# EAGLE design untitled (EAGLE 6.5.0)
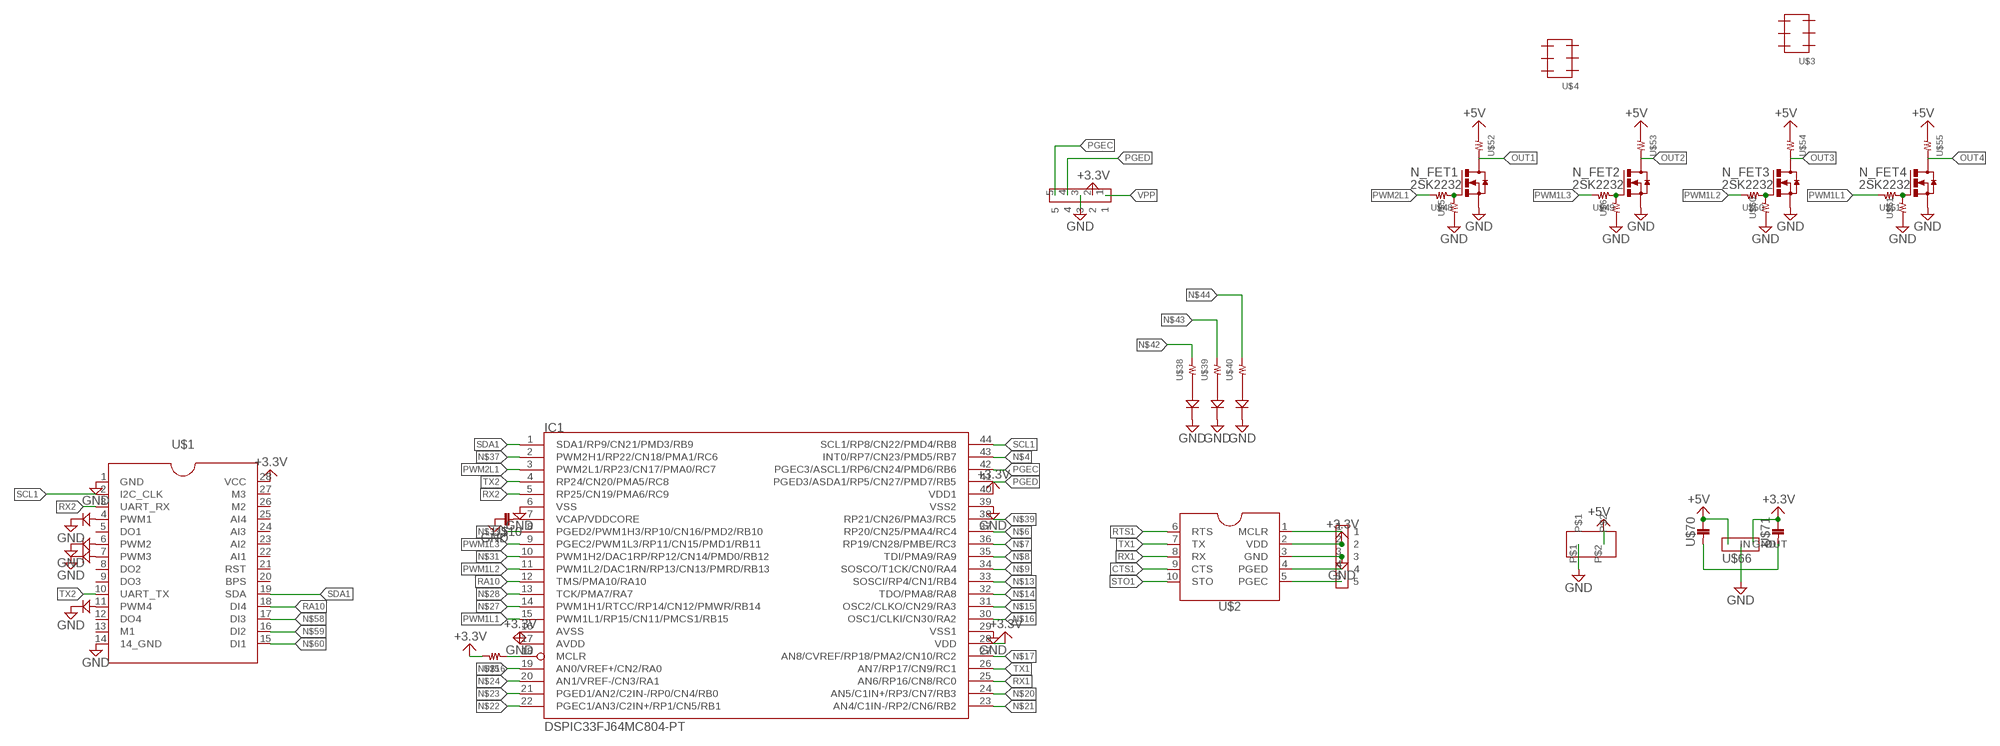
[diagram p0: schematic, sheet 1]

## Parts
IC1  DSPIC33FJ64MC804-PT  [TQFP44]
N_FET1  2SK2232  [TO-220_V]
N_FET2  2SK2232  [TO-220_V]
N_FET3  2SK2232  [TO-220_V]
N_FET4  2SK2232  [TO-220_V]
U$1  TWE-LITE  [DIP28]
U$2  SBDBT  [DIL10]
U$3  PIN_HEADER_32  [PIN_HEADER_3*2]
U$4  PIN_HEADER_32  [PIN_HEADER_3*2]
U$5  RESISTOR__SMD  [1608]
U$6  RESISTOR__SMD  [1608]
U$10  2012  [2012]
U$16  RESISTOR__SMD  [1608]
U$18  PIN_HEADER_5  [PIN_HEADER_5]
U$24  PIN_HEADER_5  [PIN_HEADER_5]
U$27  5MMLED  [5MM]
U$28  5MMLED  [5MM]
U$29  5MMLED  [5MM]
U$30  5MMLED  [5MM]
U$35  3MMLED  [3MM]
U$36  3MMLED  [3MM]
U$37  3MMLED  [3MM]
U$38  RESISTOR__SMD  [1608]
U$39  RESISTOR__SMD  [1608]
U$40  RESISTOR__SMD  [1608]
U$48  RESISTOR__SMD  [1608]
U$49  RESISTOR__SMD  [1608]
U$50  RESISTOR__SMD  [1608]
U$51  RESISTOR__SMD  [1608]
U$52  RESISTOR__SMD  [1608]
U$53  RESISTOR__SMD  [1608]
U$54  RESISTOR__SMD  [1608]
U$55  RESISTOR__SMD  [1608]
U$60  RESISTOR__SMD  [1608]
U$61  RESISTOR__SMD  [1608]
U$66  TA48M033F  [ＴＡ４８]
U$70  1608  [1608]
U$71  3225  [3225]
U$72  PIN_HEADER_2  [PIN_HEADER_2S]

## Nets
+3.3V: IC1.17(AVDD) IC1.28(VDD) IC1.40(VDD1) U$1.28(VCC) U$2.2(VDD) U$16.2 U$18.2 U$24.2 U$66.3(OUT) U$71.P$1
+5V: U$52.1 U$53.1 U$54.1 U$55.1 U$66.1(IN) U$70.P$1 U$72.P$2
CTS1: U$2.9(CTS)
GND: IC1.6(VSS) IC1.16(AVSS) IC1.29(VSS1) IC1.39(VSS2) N_FET1.3(S) N_FET2.3(S) N_FET3.3(S) N_FET4.3(S) U$1.1(GND) U$1.14(14_GND) U$2.3(GND) U$5.1 U$6.1 U$10.1 U$18.3 U$24.3 U$27.K U$28.K U$29.K U$30.K U$35.K U$36.K U$37.K U$60.1 U$61.1 U$66.2(GND) U$70.P$2 U$71.P$2 U$72.P$1
N$1: U$35.A U$38.1
N$4: IC1.43(INT0/RP7/CN23/PMD5/RB7)
N$6: IC1.37(RP20/CN25/PMA4/RC4)
N$7: IC1.36(RP19/CN28/PMBE/RC3)
N$8: IC1.35(TDI/PMA9/RA9)
N$9: IC1.34(SOSCO/T1CK/CN0/RA4)
N$10: U$2.4(PGED) U$24.4
N$11: U$2.1(MCLR) U$24.1
N$12: U$2.5(PGEC) U$24.5
N$13: IC1.33(SOSCI/RP4/CN1/RB4)
N$14: IC1.32(TDO/PMA8/RA8)
N$15: IC1.31(OSC2/CLKO/CN29/RA3)
N$16: IC1.30(OSC1/CLKI/CN30/RA2)
N$17: IC1.27(AN8/CVREF/RP18/PMA2/CN10/RC2)
N$18: U$1.4(PWM1) U$27.A
N$19: U$1.6(PWM2) U$28.A
N$20: IC1.24(AN5/C1IN+/RP3/CN7/RB3)
N$21: IC1.23(AN4/C1IN-/RP2/CN6/RB2)
N$22: IC1.22(PGEC1/AN3/C2IN+/RP1/CN5/RB1)
N$23: IC1.21(PGED1/AN2/C2IN-/RP0/CN4/RB0)
N$24: IC1.20(AN1/VREF-/CN3/RA1)
N$25: IC1.19(AN0/VREF+/CN2/RA0)
N$27: IC1.14(PWM1H1/RTCC/RP14/CN12/PMWR/RB14)
N$28: IC1.13(TCK/PMA7/RA7)
N$31: IC1.10(PWM1H2/DAC1RP/RP12/CN14/PMD0/RB12)
N$33: IC1.8(PGED2/PWM1H3/RP10/CN16/PMD2/RB10)
N$34: U$1.7(PWM3) U$29.A
N$35: U$1.11(PWM4) U$30.A
N$37: IC1.2(PWM2H1/RP22/CN18/PMA1/RC6)
N$38: U$36.A U$39.1
N$39: IC1.38(RP21/CN26/PMA3/RC5)
N$41: U$37.A U$40.1
N$42: U$38.2
N$43: U$39.2
N$44: U$40.2
N$45: N_FET1.1(G) U$5.2 U$48.1
N$46: N_FET2.1(G) U$6.2 U$49.1
N$47: N_FET3.1(G) U$50.1 U$60.2
N$48: N_FET4.1(G) U$51.1 U$61.2
N$58: U$1.17(DI3)
N$59: U$1.16(DI2)
N$60: U$1.15(DI1)
OUT1: N_FET1.2(D) U$52.2
OUT2: N_FET2.2(D) U$53.2
OUT3: N_FET3.2(D) U$54.2
OUT4: N_FET4.2(D) U$55.2
PGEC: IC1.42(PGEC3/ASCL1/RP6/CN24/PMD6/RB6) U$18.5
PGED: IC1.41(PGED3/ASDA1/RP5/CN27/PMD7/RB5) U$18.4
PWM1L1: IC1.15(PWM1L1/RP15/CN11/PMCS1/RB15) U$51.2
PWM1L2: IC1.11(PWM1L2/DAC1RN/RP13/CN13/PMRD/RB13) U$50.2
PWM1L3: IC1.9(PGEC2/PWM1L3/RP11/CN15/PMD1/RB11) U$49.2
PWM2L1: IC1.3(PWM2L1/RP23/CN17/PMA0/RC7) U$48.2
RA10: IC1.12(TMS/PMA10/RA10) U$1.18(DI4)
RTS1: U$2.6(RTS)
RX1: IC1.25(AN6/RP16/CN8/RC0) U$2.8(RX)
RX2: IC1.5(RP25/CN19/PMA6/RC9) U$1.3(UART_RX)
SCL1: IC1.44(SCL1/RP8/CN22/PMD4/RB8) U$1.2(I2C_CLK)
SDA1: IC1.1(SDA1/RP9/CN21/PMD3/RB9) U$1.19(SDA)
STO1: U$2.10(STO)
TX1: IC1.26(AN7/RP17/CN9/RC1) U$2.7(TX)
TX2: IC1.4(RP24/CN20/PMA5/RC8) U$1.10(UART_TX)
VCAP/VDDCORE: IC1.7(VCAP/VDDCORE) U$10.2
VPP: IC1.18(MCLR) U$16.1 U$18.1
Unconnected: U$1.5(DO1) U$1.8(DO2) U$1.9(DO3) U$1.12(DO4) U$1.13(M1) U$1.20(BPS) U$1.21(RST) U$1.22(AI1) U$1.23(AI2) U$1.24(AI3) U$1.25(AI4) U$1.26(M2) U$1.27(M3) U$3.P$1 U$3.P$2 U$3.P$3 U$3.P$4 U$3.P$5 U$3.P$6 U$4.P$1 U$4.P$2 U$4.P$3 U$4.P$4 U$4.P$5 U$4.P$6

## Library data of the parts
IC1 = microchip-dspic33fjxxmc (1):DSPIC33FJ64MC804: dsPIC33FJ32MC302/304, dsPIC33FJ64MCX02/X04, AND dsPIC33FJ128MCX02/X04 High-Performance, 16-bit Digital Signal Controllers Package:44 Pin TQFP Operating Range: * Up to 40 MIPS operation (at 3.0V -3.6V): - Industrial temperature range (-40°C to +85°C) - Extended temperature range (-40°C to +125°C) High-Performance DSC CPU: * Modified Harvard architecture * C compiler optimized instruction set * 16-bit wide data path * 24-bit wide instructions * Linear program memory addressing up to 4M instruction words * Linear data memory addressing up to 64 Kbytes * 83 base instructions: mostly 1 word/1 cycle * Two 40-bit accumulators with rounding and saturation options * Flexible and powerful addressing modes: - Indirect - Modulo - Bit-Reversed * Software stack * 16 x 16 fractional/integer multiply operations * 32/16 and 16/16 divide operations * Single-cycle multiply and accumulate: - Accumulator write back for DSP operations - Dual data fetch * Up to ±16-bit shifts for up to 40-bit data Direct Memory Access (DMA): * 8-channel hardware DMA * Up to 2 Kbytes dual ported DMA buffer area (DMA RAM) to store data transferred via DMA: - Allows data transfer between RAM and a peripheral while CPU is executing code (no cycle stealing) * Most peripherals support DMA Timers/Capture/Compare/PWM: * Timer/Counters, up to five 16-bit timers: - Can pair up to make two 32-bit timers - One timer runs as a Real-Time Clock with an external 32.768 kHz oscillator - Programmable prescaler * Input Capture (up to four channels): - Capture on up, down or both edges - 16-bit capture input functions - 4-deep FIFO on each capture * Output Compare (up to four channels): - Single or Dual 16-bit Compare mode - 16-bit Glitchless PWM mode * Hardware Real-Time Clock/Calendar (RTCC): - Provides clock, calendar, and alarm functions Interrupt Controller: * 5-cycle latency * Up to 53 available interrupt sources * Up to three external interrupts * Seven programmable priority levels * Five processor exceptions Digital I/O: * Peripheral pin Select functionality * Up to 35 programmable digital I/O pins * Wake-up/Interrupt-on-Change for up to 31 pins * Output pins can drive from 3.0V to 3.6V * Up to 5V output with open drain configuration * All digital input pins are 5V tolerant * 4 mA sink on all I/O pins On-Chip Flash and SRAM: * Flash program memory (up to 128 Kbytes) * Data SRAM (up to 16 Kbytes) * Boot, Secure, and General Security for program Flash System Management: * Flexible clock options: - External, crystal, resonator, internal RC - Fully integrated Phase-Locked Loop (PLL) - Extremely low jitter PLL * Power-up Timer * Oscillator Start-up Timer/Stabilizer * Watchdog Timer with its own RC oscillator * Fail-Safe Clock Monitor * Reset by multiple sources Power Management: * On-chip 2.5V voltage regulator * Switch between clock sources in real time * Idle, Sleep, and Doze modes with fast wake-up Analog-to-Digital Converters (ADCs): * 10-bit, 1.1 Msps or 12-bit, 500 Ksps conversion: - Two and four simultaneous samples (10-bit ADC) - Up to nine input channels with auto-scanning - Conversion start can be manual or synchronized with one of four trigger sources - Conversion possible in Sleep mode - ±2 LSb max integral nonlinearity - ±1 LSb max differential nonlinearity Audio Digital-to-Analog Converter (DAC): - 16-bit Dual Channel DAC module - 100 Ksps maximum sampling rate - Second-Order Digital Delta-Sigma Modulator Comparator Module: * Two analog comparators with programmable input/output configuration CMOS Flash Technology: * Low-power, high-speed Flash technology * Fully static design * 3.3V (±10%) operating voltage * Industrial and Extended temperature * Low power consumption Motor Control Peripherals: * 6-channel 16-bit Motor Control PWM: - Three duty cycle generators - Independent or Complementary mode - Programmable dead-time and output polarity - Edge-aligned or center-aligned - Manual output override control - One Fault input - Trigger for ADC conversions - PWM frequency for 16-bit resolution (@ 40 MIPS) = 1220 Hz for Edge-Aligned mode, 610 Hz for Center-Aligned mode - PWM frequency for 11-bit resolution (@ 40 MIPS) = 39.1 kHz for Edge-Aligned mode, 19.55 kHz for Center-Aligned mode * 2-channel 16-bit Motor Control PWM: - One duty cycle generator - Independent or Complementary mode - Programmable dead time and output polarity - Edge-aligned or center-aligned - Manual output override control - One Fault input - Trigger for ADC conversions - PWM frequency for 16-bit resolution (@ 40 MIPS) = 1220 Hz for Edge-Aligned mode, 610 Hz for Center-Aligned mode - PWM frequency for 11-bit resolution (@ 40 MIPS) = 39.1 kHz for Edge-Aligned mode, 19.55 kHz for Center-Aligned mode * 2-Quadrature Encoder Interface module: - Phase A, Phase B, and index pulse input - 16-bit up/down position counter - Count direction status - Position Measurement (x2 and x4) mode - Programmable digital noise filters on inputs - Alternate 16-bit Timer/Counter mode - Interrupt on position counter rollover/underflow
N_FET1-N_FET4 = 06_FET:2SK2232
U$1 = 12_module:TWE-LITE
U$2 = 12_module:SBDBT
U$3 U$4 = 08_CONECTOR:PIN_HEADER_3*2
U$5 U$6 U$16 U$38-U$40 U$48-U$55 U$60 U$61 = 01_R:RESISTOR__SMD
U$10 = 02_C:2012
U$18 U$24 = 08_CONECTOR:PIN_HEADER_5
U$27-U$30 = 10_LED:5MMLED
U$35-U$37 = 10_LED:3MMLED
U$66 = 04_IC:TA48M033F
U$70 = 02_C:1608
U$71 = 02_C:3225
U$72 = 08_CONECTOR:PIN_HEADER_2

## Board
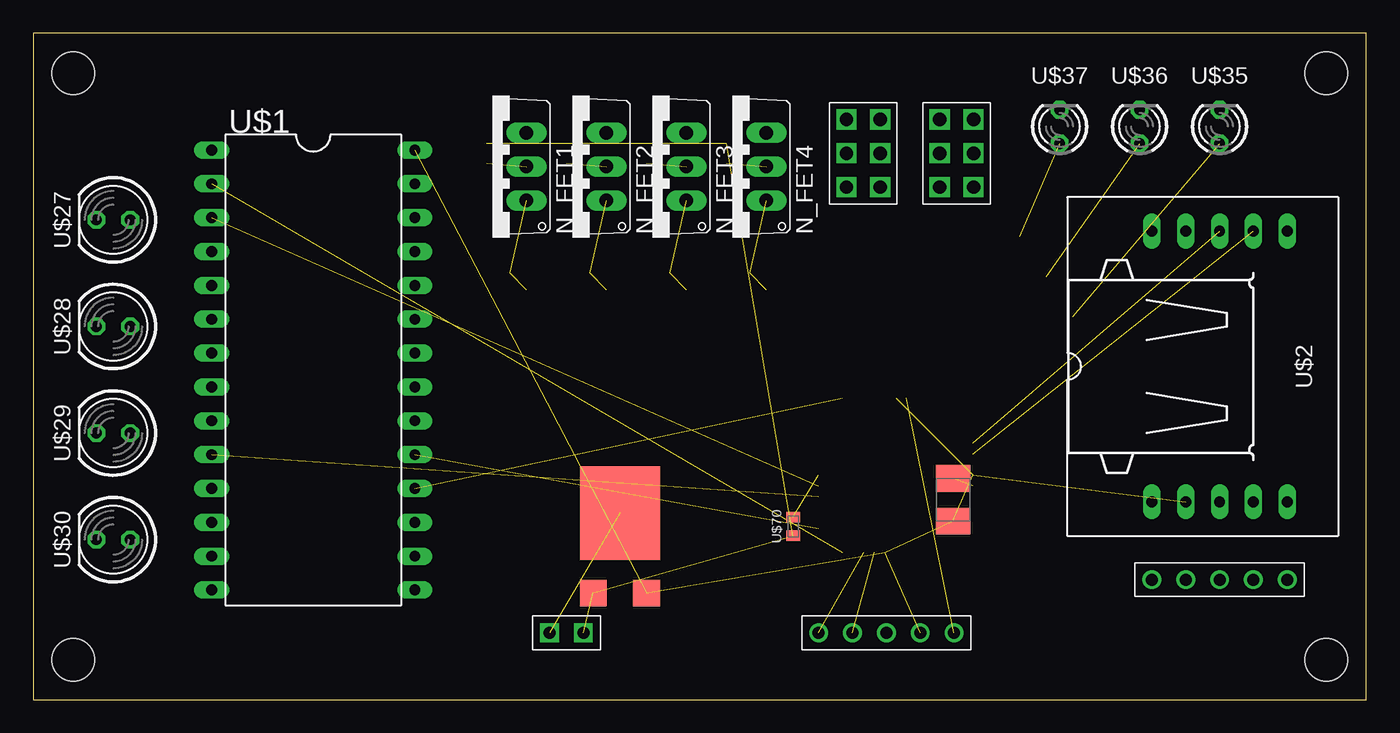
[diagram p1: board, top side]
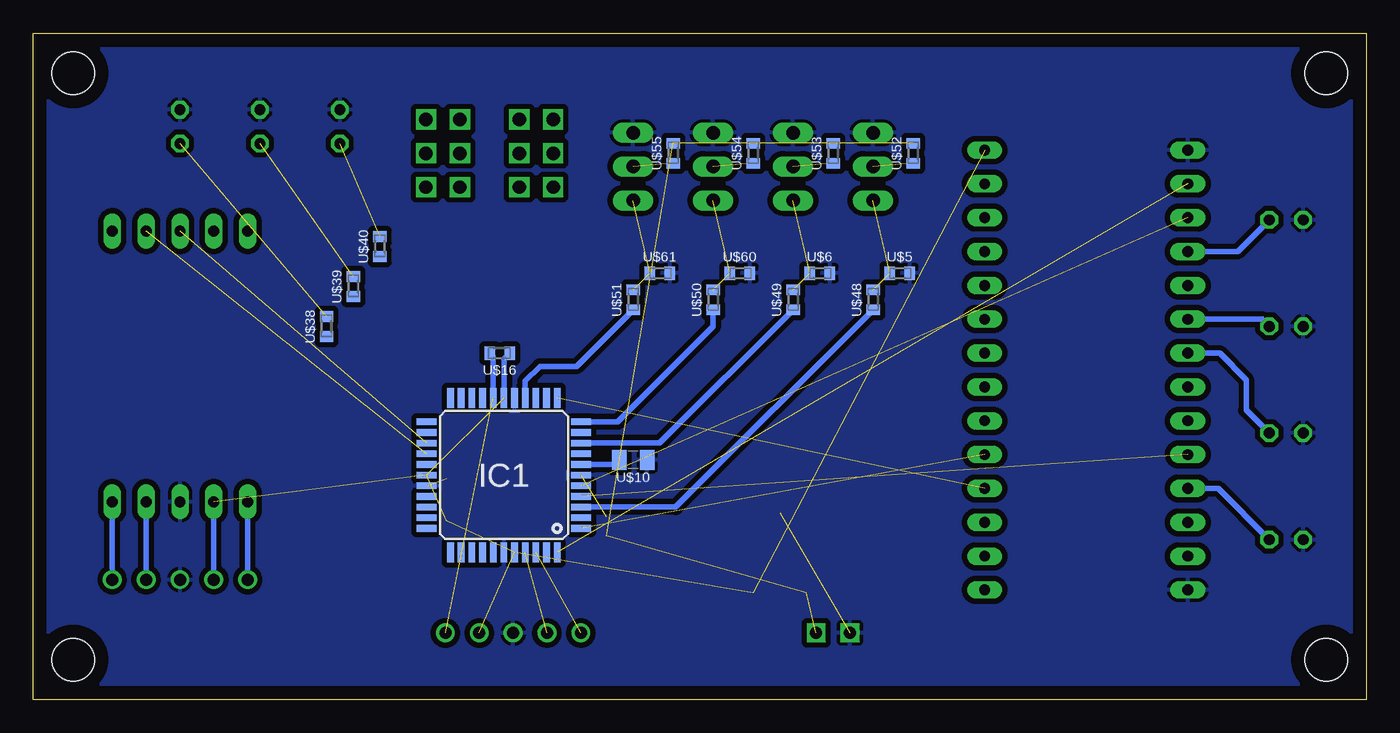
[diagram p2: board, bottom side, seen from below]

Size 100 x 50 mm. Coordinates in mm from the lower left corner, seen from the top.
Outline: 0,0 100,0 100,50 0,50 0,0
Copper layers (1*16): Top 0.035mm / dielectric 1.5mm / Bottom 0.035mm
Design rules "default": minimum track width 10mil, minimum drill 24mil, track to track 8mil, track to pad 8mil, pad to pad 8mil, via to via 8mil, smd to smd 8mil, copper to edge 40mil, drill to drill 8mil, minimum pad ring 10mil, minimum via ring 8mil, stop-mask expansion 4mil, vias tented up to drill 0mil, thermal gap 10mil
Holes 3.2 mm at 3,47 3,3 97,3 97,47

### Footprints (pad centres in the part's own frame; a part is rotated, then mirrored left to right if it is on the bottom)
TQFP44 = smd 1.5 x 0.5: 1 -5.8,4; 2 -5.8,3.2; 3 -5.8,2.4; 4 -5.8,1.6; 5 -5.8,0.8; 6 -5.8,0; 7 -5.8,-0.8; 8 -5.8,-1.6; 9 -5.8,-2.4; 10 -5.8,-3.2; 11 -5.8,-4; 23 5.8,-4; 24 5.8,-3.2; 25 5.8,-2.4; 26 5.8,-1.6; 27 5.8,-0.8; 28 5.8,0; 29 5.8,0.8; 30 5.8,1.6; 31 5.8,2.4; 32 5.8,3.2; 33 5.8,4 | smd 0.5 x 1.5: 12 -4,-5.8; 13 -3.2,-5.8; 14 -2.4,-5.8; 15 -1.6,-5.8; 16 -0.8,-5.8; 17 0,-5.8; 18 0.8,-5.8; 19 1.6,-5.8; 20 2.4,-5.8; 21 3.2,-5.8; 22 4,-5.8; 34 4,5.8; 35 3.2,5.8; 36 2.4,5.8; 37 1.6,5.8; 38 0.8,5.8; 39 0,5.8; 40 -0.8,5.8; 41 -1.6,5.8; 42 -2.4,5.8; 43 -3.2,5.8; 44 -4,5.8
TO-220_V = drill 1.016 long: 1 -2.54,0; 2 0,0; 3 2.54,0
DIP28 = drill 0.813 long: 1 -15.24,-7.62; 2 -12.7,-7.62; 3 -10.16,-7.62; 4 -7.62,-7.62; 5 -5.08,-7.62; 6 -2.54,-7.62; 7 0,-7.62; 8 2.54,-7.62; 9 5.08,-7.62; 10 7.62,-7.62; 11 10.16,-7.62; 12 12.7,-7.62; 13 15.24,-7.62; 14 17.78,-7.62; 15 17.78,7.62; 16 15.24,7.62; 17 12.7,7.62; 18 10.16,7.62; 19 7.62,7.62; 20 5.08,7.62; 21 2.54,7.62; 22 0,7.62; 23 -2.54,7.62; 24 -5.08,7.62; 25 -7.62,7.62; 26 -10.16,7.62; 27 -12.7,7.62; 28 -15.24,7.62
DIL10 = drill 0.813 long: 1 -10.16,5.08; 2 -10.16,2.54; 3 -10.16,0; 4 -10.16,-2.54; 5 -10.16,-5.08; 6 10.16,-5.08; 7 10.16,-2.54; 8 10.16,0; 9 10.16,2.54; 10 10.16,5.08
PIN_HEADER_3*2 = drill 1 pad 1.5 square: P$1 -2.54,0; P$2 0,0; P$3 2.54,0; P$4 -2.54,-2.54; P$5 0,-2.54; P$6 2.54,-2.54
1608 = smd 0.8 x 1: 1 -0.75,0; 2 0.75,0
2012 = smd 1.1 x 1.5: 1 -1.05,0; 2 1.05,0
PIN_HEADER_5 = drill 0.9: 1 -5.08,0; 2 -2.54,0; 3 0,0; 4 2.54,0; 5 5.08,0
5MM = drill 0.813 octagon: A 0,-1.27; K 0,1.27
3MM = drill 0.813 octagon: A 0,1.27; K 0,-1.27
ＴＡ４８ = smd 2 x 2: 1 -2,-3; 3 2,-3 | smd 6 x 7: 2 0,3
1608' = smd 0.8 x 1: P$1 -0.7,0; P$2 0.7,0
3225 = smd 2 x 2.6: P$1 -1.6,0; P$2 1.6,0
PIN_HEADER_2S = drill 0.9 square: P$1 -1.27,0; P$2 1.27,0

### Placement (x,y rotation side)
IC1  64.7,16.84 180 bottom
N_FET1  37,40 90 top
N_FET2  43,40 90 top
N_FET3  49,40 90 top
N_FET4  55,40 90 top
U$1  21,26 270 top
U$2  89,25 90 top
U$3  61,41 90 top
U$4  68,41 90 top
U$5  35,32 180 bottom
U$6  41,32 180 bottom
U$10  55,18 180 bottom
U$16  65,26 0 bottom
U$18  64,5 180 top
U$24  89,9 0 top
U$27  6,36 90 top
U$28  6,28 90 top
U$29  6,20 90 top
U$30  6,12 90 top
U$35  89,43 180 top
U$36  83,43 180 top
U$37  77,43 180 top
U$38  78,28 270 bottom
U$39  76,31 270 bottom
U$40  74,34 270 bottom
U$48  37,30 270 bottom
U$49  43,30 270 bottom
U$50  49,30 270 bottom
U$51  55,30 270 bottom
U$52  34,41 270 bottom
U$53  40,41 270 bottom
U$54  46,41 270 bottom
U$55  52,41 270 bottom
U$60  47,32 180 bottom
U$61  53,32 180 bottom
U$66  44,11 0 top
U$70  [1608']  57,13 90 top
U$71  69,15 90 top
U$72  40,5 0 top

### Tracks (layer width: path | path; a pad name or v marks a point on that pad's centre or on a via)
+3.3V  (7 unrouted)
  Bottom 0.4: U$24.2 U$2.2 | U$16.2 64.7,25.55 IC1.17
+5V  (6 unrouted)
GND  (3 unrouted)
  pour Bottom (isolate 0.4): 0,50 100,50 100,0 0,0
N$1  (1 unrouted)
N$2  (via drill 0.6)
  other vias: 3,47
N$3  (via drill 0.6)
  other vias: 3,3
N$5  (via drill 0.6)
  other vias: 97,3
N$10
  Bottom 0.4: U$24.4 U$2.4
N$11
  Bottom 0.4: U$24.1 U$2.1
N$12
  Bottom 0.4: U$24.5 U$2.5
N$18
  Bottom 0.4: U$1.4 9.65,33.62 U$27.A
N$19
  Bottom 0.4: U$1.6 7.81,28.54 U$28.A
N$34
  Bottom 0.4: U$1.7 11,26 9,24 9,21.73 U$29.A
N$35
  Bottom 0.4: U$1.11 11.11,15.84 U$30.A
N$38  (1 unrouted)
N$40  (via drill 0.6)
  other vias: 97,47
N$41  (1 unrouted)
N$45  (2 unrouted)
N$46  (2 unrouted)
N$47  (2 unrouted)
N$48  (2 unrouted)
OUT1  (1 unrouted)
OUT2  (1 unrouted)
OUT3  (1 unrouted)
OUT4  (1 unrouted)
PGEC  (1 unrouted)
PGED  (1 unrouted)
PWM1L1
  Bottom 0.4: U$51.2 59.25,25 62,25 63.1,23.9 IC1.15
PWM1L2
  Bottom 0.4: U$50.2 49,28 56.16,20.84 IC1.11
PWM1L3
  Bottom 0.4: U$49.2 53.01,19.24 IC1.9
PWM2L1
  Bottom 0.4: U$48.2 51.81,14.44 IC1.3
RA10  (1 unrouted)
RX1  (1 unrouted)
RX2  (1 unrouted)
SCL1  (1 unrouted)
SDA1  (1 unrouted)
TX1  (1 unrouted)
TX2  (1 unrouted)
VCAP/VDDCORE
  Bottom 0.4: U$10.2 56.41,17.64 IC1.7
VPP  (1 unrouted)
  Bottom 0.4: U$16.1 65.5,25.75 IC1.18